# EAGLE design vibrationmodule (EAGLE 9.1.0)
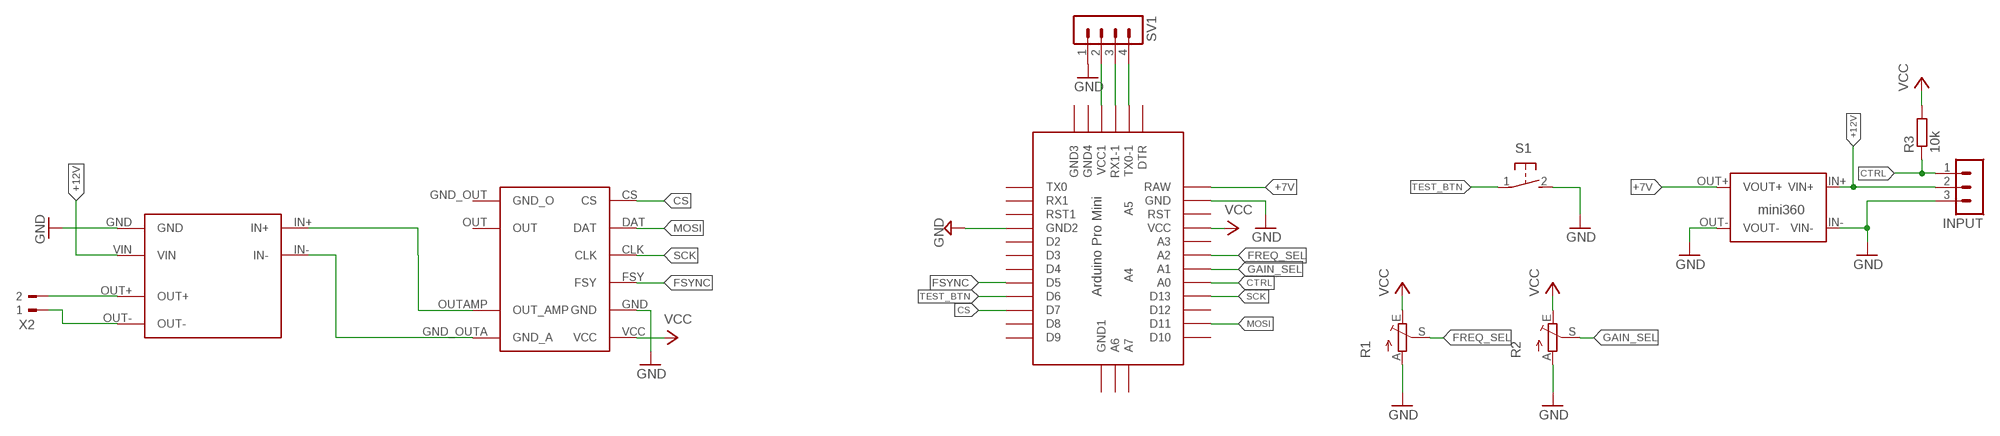
[diagram p0: schematic, sheet 1]

## Parts
INPUT  MA03-1  [MA03-1]
R1  TRIM_EU-CA9H  [CA9H]
R2  TRIM_EU-CA9H  [CA9H]
R3  10k  R-EU_M0805  [M0805]
S1  31-XX  [B3F-31XX]
SV1  MA04-1  [MA04-1]
U$1  AD9833AMP  [AD9833AMP]
U$2  MINI360  [MINI360]
U$3  HW328  [HW328]
U$5  ABK-PRO-MINI  [ABK-PRO-MINI]
X2  90-2  [90-2]

## Nets
+7V: U$2.OUT+(VOUT+) U$5.RAW
+12V: INPUT.2 U$2.IN+(VIN+) U$3.VIN
CS: U$1.CS U$5.D7
CTRL: INPUT.1 R3.1 U$5.A0
FREQ_SEL: R1.S U$5.A2
FSYNC: U$1.FSY U$5.D5
GAIN_SEL: R2.S U$5.A1
GND: R1.A R2.A S1.2(S) SV1.1 U$1.GND U$2.OUT-(VOUT-) U$5.GND
GND1: INPUT.3 U$2.IN-(VIN-) U$3.GND ; supply symbol labelled GND
GND2: U$5.GND1(GND2) ; supply symbol labelled GND
MOSI: U$1.DAT U$5.D11
N$1: U$1.OUTAMP(OUT_AMP) U$3.IN+
N$2: SV1.4 U$5.TX0-1
N$3: U$3.OUT+ X2.2
N$4: U$1.GND_OUTA(GND_A) U$3.IN-
N$5: SV1.3 U$5.RX1-1
N$6: SV1.2 U$5.VCC1
N$9: U$3.OUT- X2.1
SCK: U$1.CLK U$5.D13
TEST_BTN: S1.1(P) U$5.D6
VCC: R1.E R2.E R3.2 U$1.VCC U$5.VCC
Unconnected: U$1.GND_OUT(GND_O) U$1.OUT U$5.A3 U$5.A4 U$5.A5 U$5.A6 U$5.A7 U$5.D2 U$5.D3 U$5.D4 U$5.D8 U$5.D9 U$5.D10 U$5.D12 U$5.DTR U$5.GND2(GND3) U$5.GND3(GND4) U$5.GND4(GND1) U$5.RST U$5.RST1 U$5.RX1 U$5.TX0

## Library data of the parts
INPUT = con-lstb:MA03-1: PIN HEADER; OC_FARNELL: unknown; OC_NEWARK: unknown
R1 R2 = pot:TRIM_EU-: POTENTIOMETER
R3 = resistor:R-EU_: RESISTOR, European symbol
S1 = switch-omron:31-XX: OMRON SWITCH; MPN: B3F-3100; OC_FARNELL: 959704; OC_NEWARK: 36M3582; TME: NINIGI TACTA-64K-F
SV1 = con-lstb:MA04-1: PIN HEADER; OC_FARNELL: unknown; OC_NEWARK: unknown
U$1 = AD9833AMP:AD9833AMP
U$2 = mini360:MINI360
U$3 = hw-328:HW328
U$5 = Arduino-clone:ABK-PRO-MINI: ABK Pro-Mini Arduino Clone
X2 = con-weidmueller-sl35:90-2: WEIDMUELLER CLAMP CONNECTOR; OC_FARNELL: unknown; OC_NEWARK: unknown

## Board
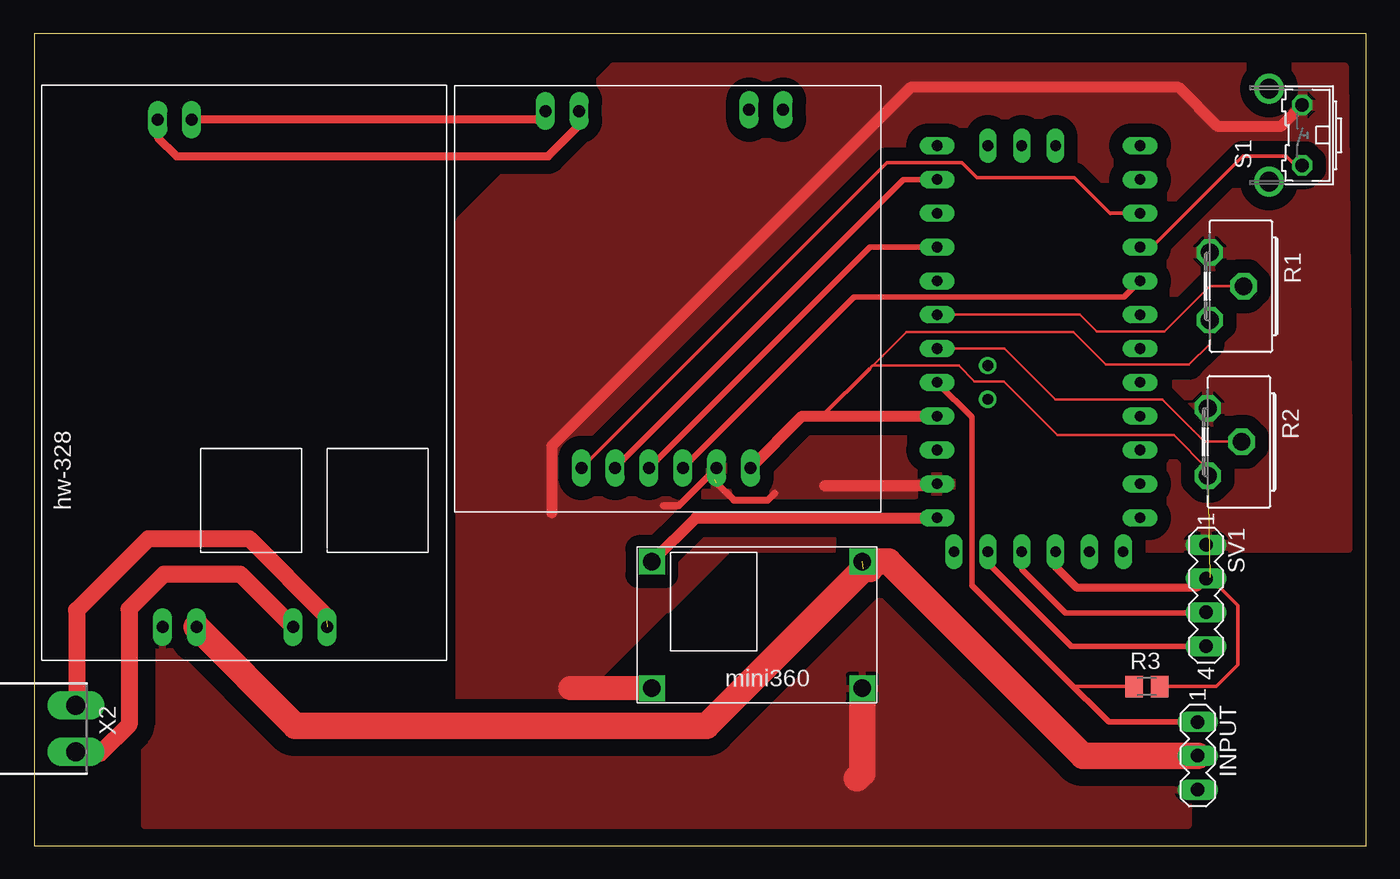
[diagram p1: board, top side]

Size 100 x 61 mm. Coordinates in mm from the lower left corner, seen from the top.
Outline: 0,61 0,0 100,0 100,61 0,61
Copper layers (1*16): Top 0.035mm / dielectric 1.5mm / Bottom 0.035mm
Design rules "default *": minimum track width 6mil, minimum drill 0.35mm, track to track 6mil, track to pad 6mil, pad to pad 6mil, via to via 6mil, smd to smd 6mil, copper to edge 20mil, drill to drill 6mil, minimum pad ring 10mil, minimum via ring 8mil, stop-mask expansion 4mil, vias tented up to drill 0mil, thermal gap 10mil

### Footprints (pad centres in the part's own frame; a part is rotated, then mirrored left to right if it is on the bottom)
MA03-1 = drill 1.016 long: 1 -2.54,0; 2 0,0; 3 2.54,0
CA9H = drill 1.321 octagon: A -2.54,0; E 2.54,0; S 0,2.54
M0805 = smd 1.3 x 1.6: 1 -0.95,0; 2 0.95,0
B3F-31XX = drill 1.016 octagon: 1 -2.261,-1.245; 2 2.261,-1.245 | drill 1.499 pad 2.159: 3 -3.505,1.245; 4 3.505,1.245
MA04-1 = drill 1.016 long: 1 -3.81,0; 2 -1.27,0; 3 1.27,0; 4 3.81,0
AD9833AMP = drill 0.9 long: CLK 3.3,17.42; CS 3.3,22.5; DAT 3.3,19.96; FSY 3.3,14.88; GND 3.3,12.34; GND_OUT 30.2,7.36; GND_OUTA 30.1,25.2; OUT 30.2,9.9; OUTAMP 30.1,22.66; VCC 3.3,9.8
MINI360 = drill 1.3 square: IN+ 16.9,10.6; IN- 16.9,1.1; OUT+ 1.1,10.6; OUT- 1.1,1.1
HW328 = drill 0.9 long: GND 2.5,21.34; IN+ 40.6,21.7; IN- 40.6,19.16; OUT+ 2.5,11.54; OUT- 2.5,9; VIN 2.5,18.8
ABK-PRO-MINI = drill 0.8 long: A0 10.16,-3.81; A1 10.16,-6.35; A2 10.16,-8.89; A3 10.16,-11.43; A6 3.81,-21.59; A7 6.35,-21.59; D2 -5.08,-3.81; D3 -5.08,-6.35; D4 -5.08,-8.89; D5 -5.08,-11.43; D6 -5.08,-13.97; D7 -5.08,-16.51; D8 -5.08,-19.05; D9 -5.08,-21.59; D10 10.16,-21.59; D11 10.16,-19.05; D12 10.16,-16.51; D13 10.16,-13.97; DTR 8.89,8.89; GND 10.16,3.81; GND1 -5.08,-1.27; GND2 -3.81,8.89; GND3 -1.27,8.89; GND4 1.27,-21.59; RAW 10.16,6.35; RST 10.16,1.27; RST1 -5.08,1.27; RX1 -5.08,3.81; RX1-1 3.81,8.89; TX0 -5.08,6.35; TX0-1 6.35,8.89; VCC 10.16,-1.27; VCC1 1.27,8.89 | drill 0.8: A4 6.35,-5.08; A5 6.35,-2.54
90-2 = drill 1.422 long: 1 -1.75,5.25; 2 1.75,5.25

### Placement (x,y rotation side)
INPUT  87.35,6.74 270 top
R1  88.26,42 270 top
R2  88.11,30.31 270 top
R3  83.53,11.94 0 top
S1  93.95,53.35 90 top
SV1  87.98,18.78 270 top
U$1  63.57,25.06 90 top
U$2  45.26,10.72 0 top
U$3  30.97,13.91 90 top
U$5  77.94,30.97 180 top
X2  -2.13,8.78 270 top

### Tracks (layer width: path | path; a pad name or v marks a point on that pad's centre or on a via)
+7V
  Top 0.813: U$2.OUT+ 49.66,24.62 U$5.RAW
+12V  (1 unrouted)
  Top 2: INPUT.2 78.72,6.74 | 78.72,6.74 | 78.72,6.74 64.14,21.32 U$2.IN+ | 62.74,20.79 62.26,20.79 50.47,9 19.58,9 U$3.VIN
CS
  Top 0.254: U$5.D7 80.82,47.48 80.79,47.45 78.07,50.17 70.76,50.17 69.64,51.29 64,51.29 U$1.CS
CTRL
  Top 0.254: R3.1 78,11.94 77.3,12.64
  Top 0.406: INPUT.1 80.66,9.28 77.3,12.64 70.39,19.55 70.39,28.48 70.39,32.17 U$5.A0
FREQ_SEL
  Top 0.203: U$5.A2 69.64,39.86 69.65,39.87 78.5,39.87 79.77,38.6 84.84,38.6 88.24,42 R1.S
  Top 0.406: 90.75,41.95 R1.S
FSYNC
  Top 0.406: U$1.FSY 61.52,41.19 81.81,41.19 U$5.D5
GAIN_SEL
  Top 0.203: U$5.A1 72.84,37.32 76.65,33.51 84.69,33.51 87.86,30.34 90.62,30.34 R2.S
GND  (1 unrouted)
  Top 0.508: 47.22,25.51 48.38,25.51 U$1.GND 51.23,27.23 52.52,25.94 55.07,25.94 55.6,26.47
  Top 0.813: 68.63,27.16 U$5.GND 67.64,27.02 59.33,27.02 | 51.11,28.24 U$1.GND | 51.09,27.5 51.44,27.85 | S1.2 93.58,54 88.87,54 85.92,56.95 65.8,56.95 38.85,30 38.85,24.98 | 59.33,27.02
  Top 1.016: 40.25,11.82 40.01,11.58
  Top 1.8: U$2.OUT- 40.25,11.82
  pour Top (isolate 1.016): 43.56,58.43 98.29,58.43 98.6,22.38 52.04,22.38 47.54,17.88 47.36,17.88 38.01,8.53 32.04,8.53 32.04,46.91
GND1
  Top 2: U$2.IN- 62.16,5.44 61.76,5.04
  pour Top (isolate 1.27, rank 2): 8.28,18.57 86.64,18.57 86.64,1.5 8.28,1.5 8.28,18.54
MOSI
  Top 0.406: U$1.DAT 65.27,50.02 U$5.D11
N$1
  Top 0.61: U$3.IN+ 9.27,53.17 10.68,51.76 38.58,51.76 40.94,54.12 40.91,54.15 U$1.OUTAMP
N$2
  Top 0.406: SV1.4 77.85,14.97 71.61,21.21 71.61,22.06 U$5.TX0-1
N$3
  Top 1.27: U$3.OUT+ 15.45,20.39 9.73,20.39 7.11,17.77 7.11,9.08 4.96,6.93 4.86,7.03 X2.2
N$4
  Top 0.61: U$1.GND_OUTA 37.72,54.51 U$3.IN-
N$5
  Top 0.305: 74.13,21.09 U$5.RX1-1
  Top 0.406: U$5.RX1-1 74.13,20.75 77.42,17.46 87.93,17.46 SV1.3
N$6
  Top 0.61: U$5.VCC1 76.67,20.96 78.23,19.4 87.33,19.4 SV1.2
N$9  (1 unrouted)
  Top 1.27: 21.96,16.86 21.96,17.2 16.11,23.05 8.57,23.05 3.18,17.66 3.18,10.59 X2.1
SCK
  Top 0.406: U$1.CLK 62.73,44.94 U$5.D13
TEST_BTN
  Top 0.254: U$5.D6 83.19,45.11 84.07,45.11 90.72,51.76 94.01,51.76 94.68,51.09 S1.1
  Top 0.406: 83.04,44.92 U$5.D6
VCC  (1 unrouted)
  Top 0.203: 86.08,36.11 80.44,36.11 78,38.55 65.46,38.55 63.67,36.77 62.67,35.76 62.94,36.03 64.46,36.03 | 86.08,36.11 86.7,36.11 88.25,37.66 R1.E | 86.1,36.13 86.08,36.11 | R2.E 88.11,28.26 85.55,30.82 76.81,30.82 72.8,34.83 70.6,34.83 69.4,36.03 64.46,36.03 | 64.46,36.03 64.33,36.03
  Top 0.254: R3.2 88.74,11.94 90.17,13.37 90.36,13.56 90.36,18.02 88.24,20.14
  Top 0.305: 58.34,32.24 59.15,32.24 62.67,35.76
  Top 0.406: U$5.VCC 64.33,32.24 | R1.E
  Top 0.813: U$1.VCC 57.65,32.24 58.34,32.24 U$5.VCC

### Text on the board
tDocu: out | CTRL | + | + | - | -